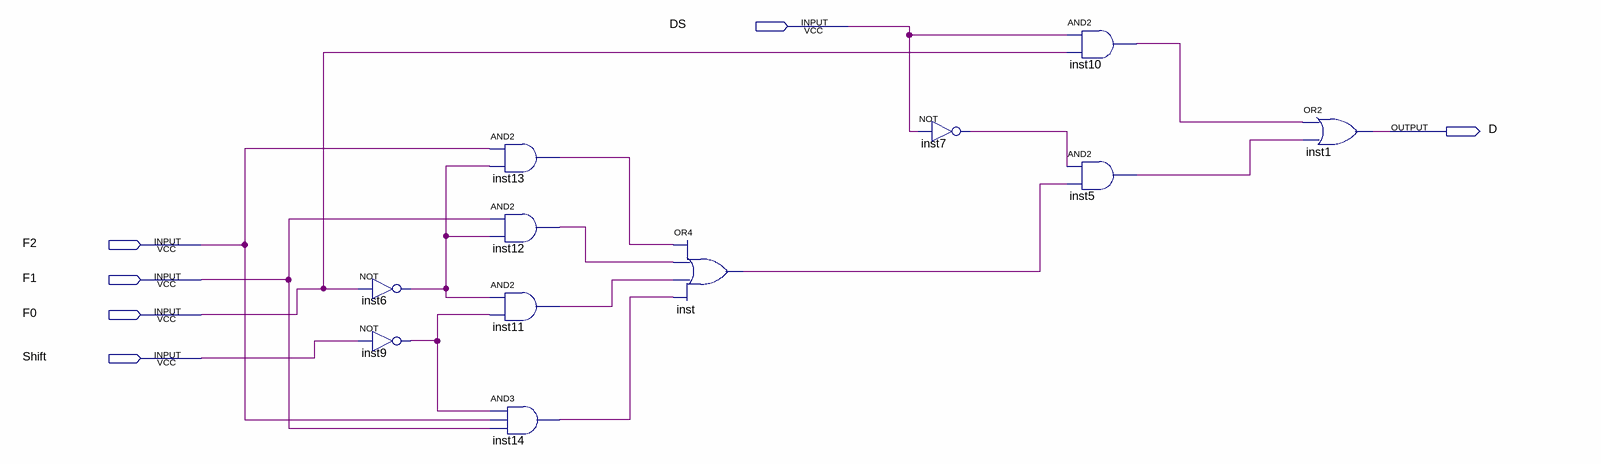
[diagram p0: schematic sheet]
// Quartus schematic entradaFFh0.bdf as structural Verilog: 11 symbols, 6 pins
module entradaFFh0 (
  input  DS,
  input  F2,
  input  F1,
  input  F0,
  input  Shift,
  output D
);

  wire inst5_out, inst6_out, inst7_out, inst9_out, inst10_out, inst11_out, inst12_out, inst13_out,
       inst14_out, inst_out;

  not inst6 (inst6_out, F0);
  not inst9 (inst9_out, Shift);
  and inst13 (inst13_out, F2, inst6_out);
  and inst12 (inst12_out, F1, inst6_out);
  and inst11 (inst11_out, inst6_out, inst9_out);
  and inst14 (inst14_out, inst9_out, F2, F1);
  or inst (inst_out, inst13_out, inst12_out, inst11_out, inst14_out);
  not inst7 (inst7_out, DS);
  and inst10 (inst10_out, DS, F0);
  and inst5 (inst5_out, inst7_out, inst_out);
  or inst1 (D, inst10_out, inst5_out);
endmodule
